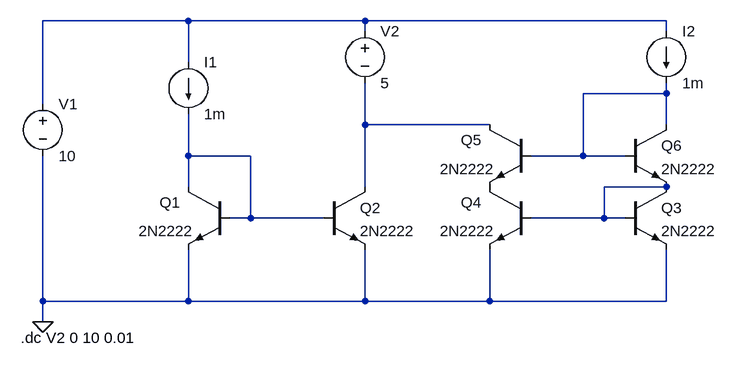
[diagram p0: schematic simu P1 Q6.asc]
simu P1 Q6.asc, the LTspice schematic file:
Version 4
SHEET 1 1240 680
WIRE 256 -128 32 -128
WIRE 528 -128 256 -128
WIRE 992 -128 528 -128
WIRE 528 -112 528 -128
WIRE 992 -112 992 -128
WIRE 256 -64 256 -128
WIRE 992 -16 992 -32
WIRE 992 -16 864 -16
WIRE 32 0 32 -128
WIRE 528 32 528 -32
WIRE 720 32 528 32
WIRE 992 32 992 -16
WIRE 256 80 256 16
WIRE 352 80 256 80
WIRE 864 80 864 -16
WIRE 864 80 784 80
WIRE 928 80 864 80
WIRE 256 128 256 80
WIRE 528 128 528 32
WIRE 992 128 896 128
WIRE 352 176 352 80
WIRE 352 176 320 176
WIRE 464 176 352 176
WIRE 896 176 896 128
WIRE 896 176 784 176
WIRE 928 176 896 176
WIRE 32 304 32 80
WIRE 256 304 256 224
WIRE 256 304 32 304
WIRE 528 304 528 224
WIRE 528 304 256 304
WIRE 720 304 720 224
WIRE 720 304 528 304
WIRE 992 304 992 224
WIRE 992 304 720 304
WIRE 32 336 32 304
FLAG 32 336 0
SYMBOL current 256 -64 R0
WINDOW 123 0 0 Left 0
WINDOW 39 0 0 Left 0
SYMATTR InstName I1
SYMATTR Value 1m
SYMBOL npn 320 128 M0
WINDOW 0 76 24 Left 2
SYMATTR InstName Q1
SYMATTR Value 2N2222
SYMBOL npn 464 128 R0
SYMATTR InstName Q2
SYMATTR Value 2N2222
SYMBOL voltage 32 -16 R0
WINDOW 123 0 0 Left 0
WINDOW 39 0 0 Left 0
SYMATTR InstName V1
SYMATTR Value 10
SYMBOL voltage 528 -128 R0
WINDOW 123 0 0 Left 0
WINDOW 39 0 0 Left 0
SYMATTR InstName V2
SYMATTR Value 5
SYMBOL current 992 -112 R0
WINDOW 123 0 0 Left 0
WINDOW 39 0 0 Left 0
SYMATTR InstName I2
SYMATTR Value 1m
SYMBOL npn 784 128 M0
WINDOW 0 76 24 Left 2
SYMATTR InstName Q4
SYMATTR Value 2N2222
SYMBOL npn 928 128 R0
SYMATTR InstName Q3
SYMATTR Value 2N2222
SYMBOL npn 784 32 M0
WINDOW 0 76 24 Left 2
SYMATTR InstName Q5
SYMATTR Value 2N2222
SYMBOL npn 928 32 R0
SYMATTR InstName Q6
SYMATTR Value 2N2222
TEXT -2 360 Left 2 !.dc V2 0 10 0.01

The netlist it stands for:
* simu P1 Q6.asc
I1 N001 N004 1m
Q1 N004 N004 0 0 2N2222
Q2 N003 N004 0 0 2N2222
V1 N001 0 10
V2 N001 N003 5
I2 N001 N002 1m
Q4 P001 N005 0 0 2N2222
Q3 N005 N005 0 0 2N2222
Q5 N003 N002 P001 0 2N2222
Q6 N002 N002 N005 0 2N2222
.model NPN NPN
.model PNP PNP
.lib standard.bjt
.dc V2 0 10 0.01
.backanno
.end